# EAGLE design SCART_SWITCH-5CH (EAGLE 7.6.0)

## Sheet 1 of 2
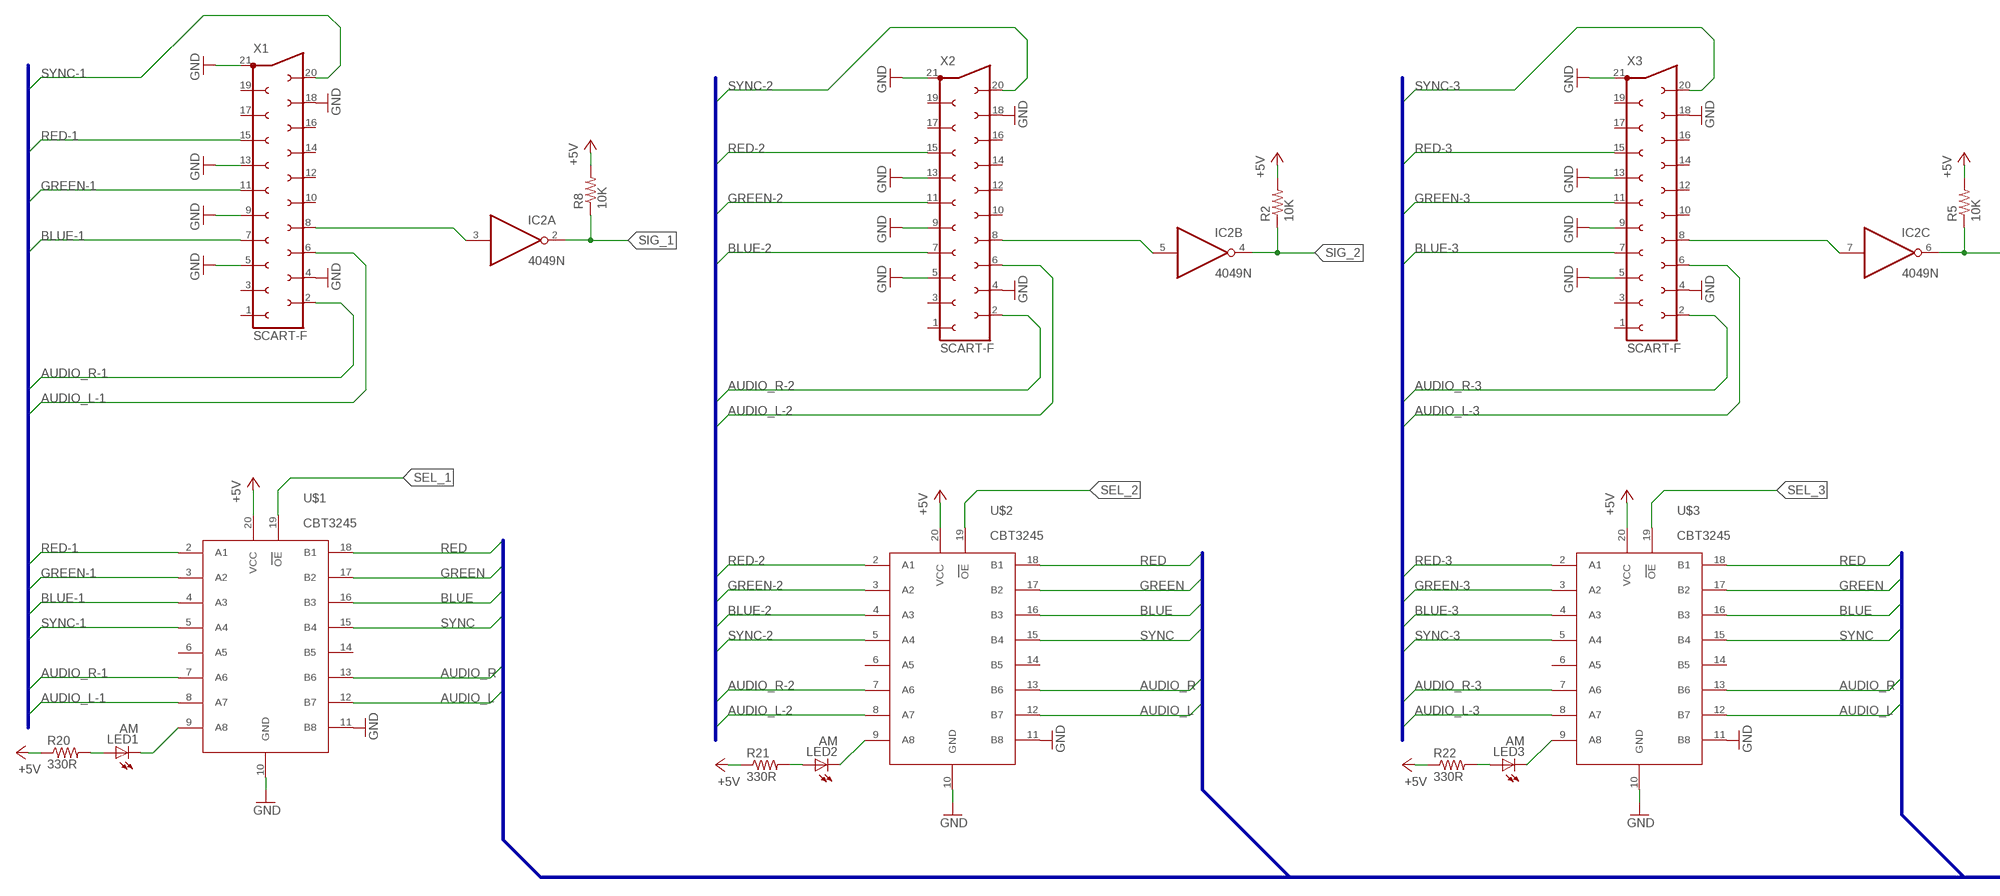
[diagram p0: schematic, sheet 1, part 1 of 2]
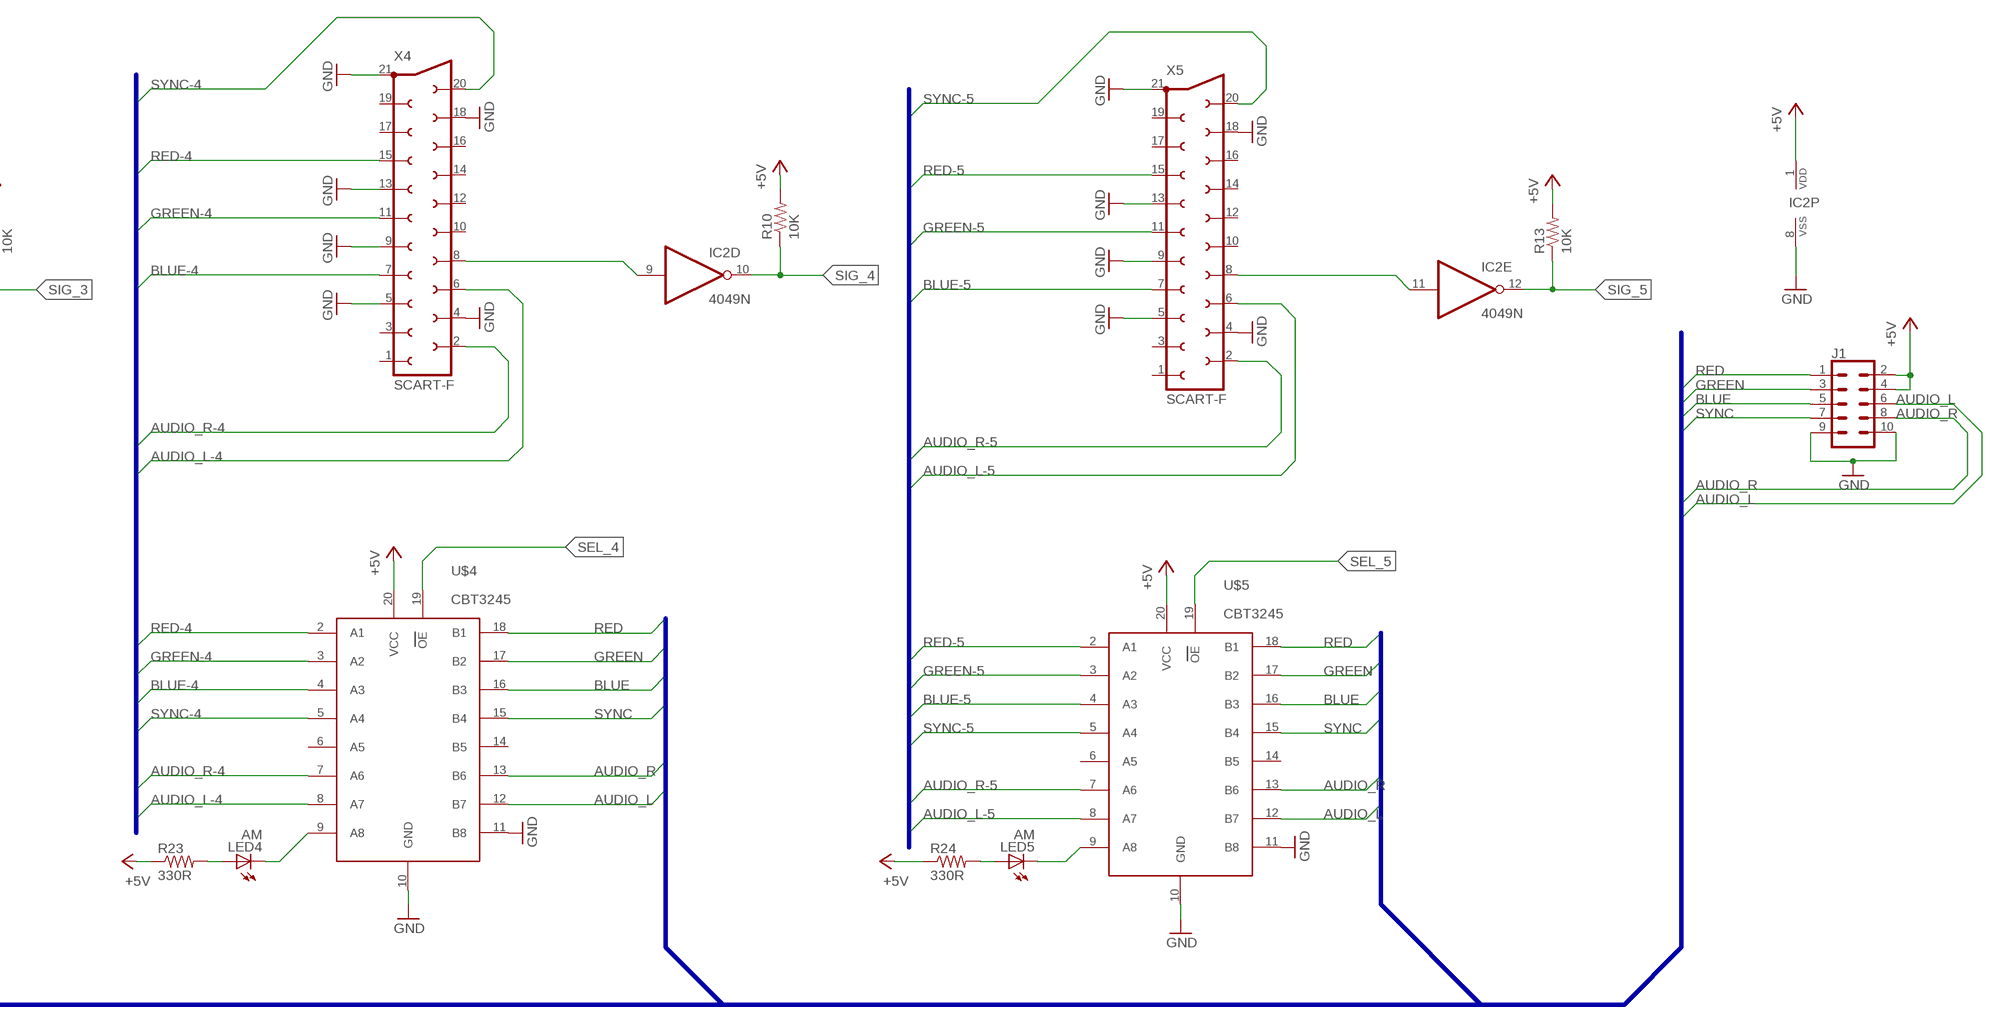
[diagram p1: schematic, sheet 1, part 2 of 2]

### Parts
IC2  4049N  [DIL16]
J1  CONN_05X2SHD  [2X5-SHROUDED]
LED1  AM  LED5MM  [LED5MM]
LED2  AM  LED5MM  [LED5MM]
LED3  AM  LED5MM  [LED5MM]
LED4  AM  LED5MM  [LED5MM]
LED5  AM  LED5MM  [LED5MM]
R2  10K  R-US_0204/7  [0204/7]
R5  10K  R-US_0204/7  [0204/7]
R8  10K  R-US_0204/7  [0204/7]
R10  10K  R-US_0204/7  [0204/7]
R13  10K  R-US_0204/7  [0204/7]
R20  330R  R-US_0207/2V  [0207/2V]
R21  330R  R-US_0207/2V  [0207/2V]
R22  330R  R-US_0207/2V  [0207/2V]
R23  330R  R-US_0207/2V  [0207/2V]
R24  330R  R-US_0207/2V  [0207/2V]
U$1  CBT3245  [SO20]
U$2  CBT3245  [SO20]
U$3  CBT3245  [SO20]
U$4  CBT3245  [SO20]
U$5  CBT3245  [SO20]
X1  SCART-F  [SCART-F]
X2  SCART-F  [SCART-F]
X3  SCART-F  [SCART-F]
X4  SCART-F  [SCART-F]
X5  SCART-F  [SCART-F]

### Nets
+5V: IC2.1(P:VDD) J1.2 J1.4 R2.2 R5.2 R8.2 R10.2 R13.2 R20.1 R21.1 R22.1 R23.1 R24.1 U$1.20(VCC) U$2.20(VCC) U$3.20(VCC) U$4.20(VCC) U$5.20(VCC) ; also sheet 2
AUDIO_L: J1.6 U$1.12(B7) U$2.12(B7) U$3.12(B7) U$4.12(B7) U$5.12(B7)
AUDIO_L-1: U$1.8(A7) X1.6
AUDIO_L-2: U$2.8(A7) X2.6
AUDIO_L-3: U$3.8(A7) X3.6
AUDIO_L-4: U$4.8(A7) X4.6
AUDIO_L-5: U$5.8(A7) X5.6
AUDIO_R: J1.8 U$1.13(B6) U$2.13(B6) U$3.13(B6) U$4.13(B6) U$5.13(B6)
AUDIO_R-1: U$1.7(A6) X1.2
AUDIO_R-2: U$2.7(A6) X2.2
AUDIO_R-3: U$3.7(A6) X3.2
AUDIO_R-4: U$4.7(A6) X4.2
AUDIO_R-5: U$5.7(A6) X5.2
BLUE: J1.5 U$1.16(B3) U$2.16(B3) U$3.16(B3) U$4.16(B3) U$5.16(B3)
BLUE-1: U$1.4(A3) X1.7
BLUE-2: U$2.4(A3) X2.7
BLUE-3: U$3.4(A3) X3.7
BLUE-4: U$4.4(A3) X4.7
BLUE-5: U$5.4(A3) X5.7
GND: IC2.8(P:VSS) J1.9 J1.10 U$1.10(GND) U$1.11(B8) U$2.10(GND) U$2.11(B8) U$3.10(GND) U$3.11(B8) U$4.10(GND) U$4.11(B8) U$5.10(GND) U$5.11(B8) X1.4 X1.5 X1.9 X1.13 X1.18 X1.21 X2.4 X2.5 X2.9 X2.13 X2.18 X2.21 X3.4 X3.5 X3.9 X3.13 X3.18 X3.21 X4.4 X4.5 X4.9 X4.13 X4.18 X4.21 X5.4 X5.5 X5.9 X5.13 X5.18 X5.21 ; also sheet 2
GREEN: J1.3 U$1.17(B2) U$2.17(B2) U$3.17(B2) U$4.17(B2) U$5.17(B2)
GREEN-1: U$1.3(A2) X1.11
GREEN-2: U$2.3(A2) X2.11
GREEN-3: U$3.3(A2) X3.11
GREEN-4: U$4.3(A2) X4.11
GREEN-5: U$5.3(A2) X5.11
N$1: IC2.3(A:I) X1.8
N$4: IC2.5(B:I) X2.8
N$7: IC2.7(C:I) X3.8
N$10: IC2.9(D:I) X4.8
N$14: IC2.11(E:I) X5.8
N$26: LED5.K(C) U$5.9(A8)
N$27: LED5.A R24.2
N$28: LED4.A R23.2
N$29: LED4.K(C) U$4.9(A8)
N$30: LED2.K(C) U$2.9(A8)
N$31: LED2.A R21.2
N$32: LED3.K(C) U$3.9(A8)
N$34: LED3.A R22.2
N$35: LED1.A R20.2
N$36: LED1.K(C) U$1.9(A8)
RED: J1.1 U$1.18(B1) U$2.18(B1) U$3.18(B1) U$4.18(B1) U$5.18(B1)
RED-1: U$1.2(A1) X1.15
RED-2: U$2.2(A1) X2.15
RED-3: U$3.2(A1) X3.15
RED-4: U$4.2(A1) X4.15
RED-5: U$5.2(A1) X5.15
SEL_1: U$1.19(OE) ; also sheet 2
SEL_2: U$2.19(OE) ; also sheet 2
SEL_3: U$3.19(OE) ; also sheet 2
SEL_4: U$4.19(OE) ; also sheet 2
SEL_5: U$5.19(OE) ; also sheet 2
SIG_1: IC2.2(A:O) R8.1 ; also sheet 2
SIG_2: IC2.4(B:O) R2.1 ; also sheet 2
SIG_3: IC2.6(C:O) R5.1 ; also sheet 2
SIG_4: IC2.10(D:O) R10.1 ; also sheet 2
SIG_5: IC2.12(E:O) R13.1 ; also sheet 2
SYNC: J1.7 U$1.15(B4) U$2.15(B4) U$3.15(B4) U$4.15(B4) U$5.15(B4)
SYNC-1: U$1.5(A4) X1.20
SYNC-2: U$2.5(A4) X2.20
SYNC-3: U$3.5(A4) X3.20
SYNC-4: U$4.5(A4) X4.20
SYNC-5: U$5.5(A4) X5.20
Unconnected: IC2.14(F:I) IC2.15(F:O) U$1.6(A5) U$1.14(B5) U$2.6(A5) U$2.14(B5) U$3.6(A5) U$3.14(B5) U$4.6(A5) U$4.14(B5) U$5.6(A5) U$5.14(B5) X1.1 X1.3 X1.10 X1.12 X1.14 X1.16 X1.17 X1.19 X2.1 X2.3 X2.10 X2.12 X2.14 X2.16 X2.17 X2.19 X3.1 X3.3 X3.10 X3.12 X3.14 X3.16 X3.17 X3.19 X4.1 X4.3 X4.10 X4.12 X4.14 X4.16 X4.17 X4.19 X5.1 X5.3 X5.10 X5.12 X5.14 X5.16 X5.17 X5.19

### Buses
B$1
B$2

## Sheet 2 of 2
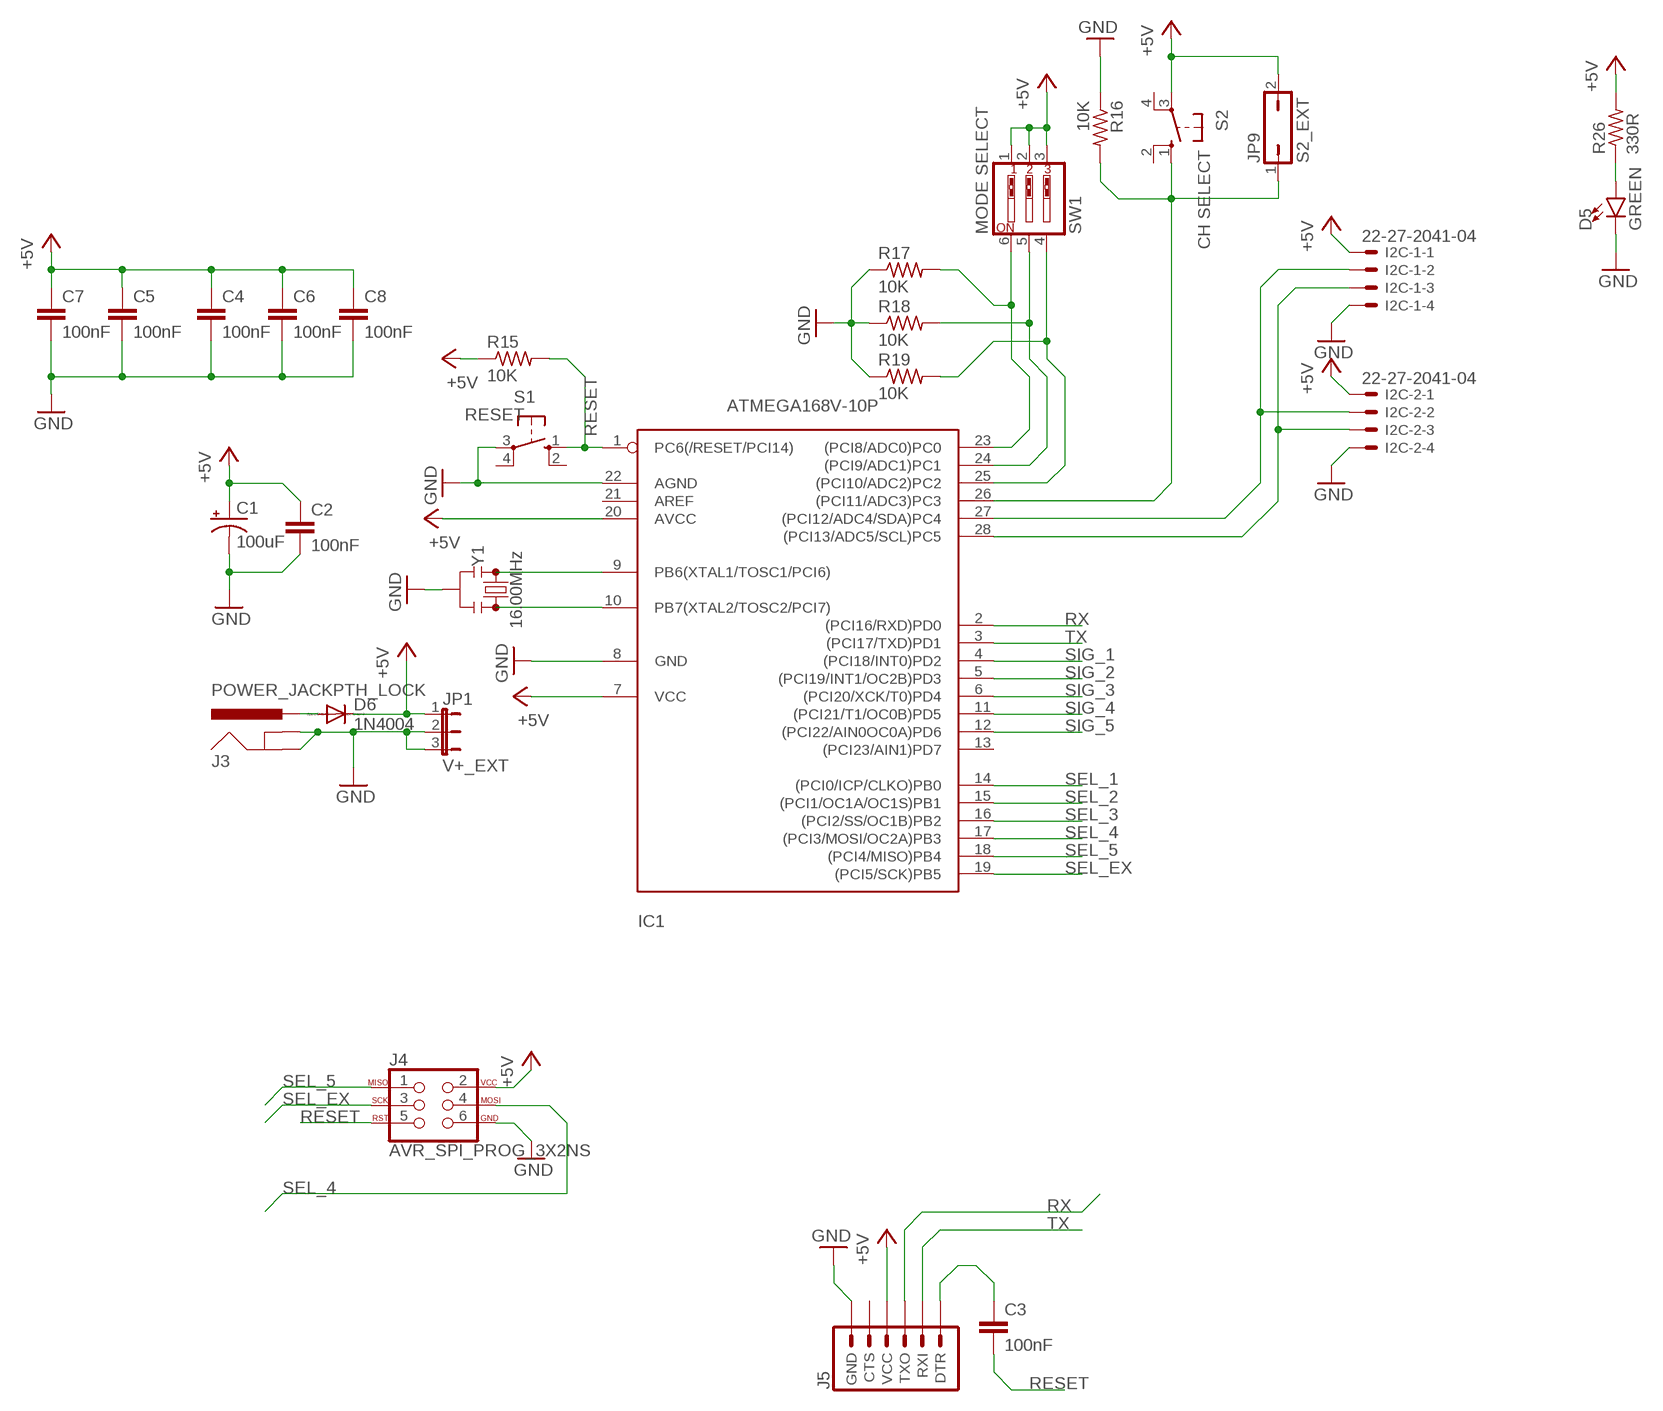
[diagram p2: schematic, sheet 2]

### Parts
C1  100uF  CPOL-USE2.5-7  [E2,5-7]
C2  100nF  C-EU075-032X103  [C075-032X103]
C3  100nF  C-EU075-032X103  [C075-032X103]
C4  100nF  C-EU075-032X103  [C075-032X103]
C5  100nF  C-EU075-032X103  [C075-032X103]
C6  100nF  C-EU075-032X103  [C075-032X103]
C7  100nF  C-EU075-032X103  [C075-032X103]
C8  100nF  C-EU075-032X103  [C075-032X103]
D5  GREEN  LED5MM  [LED_5MM]
D6  1N4004  [DO41-10]
I2C-1  22-27-2041-04  [6410-04]
I2C-2  22-27-2041-04  [6410-04]
IC1  ATMEGA168V-10P  [DIL28-3]
J3  POWER_JACKPTH_LOCK  [POWER_JACK_PTH_LOCK]
J4  AVR_SPI_PROG_3X2NS  [2X3-NS]
J5  6_PIN_SERIAL_TARGETSILK  [6_PIN_SERIAL_TARGET_SIDE_W_SILK]
JP1  V+_EXT  JP2E  [JP2]
JP9  S2_EXT  JP1Q  [JP1]
R15  10K  R-US_0204/7  [0204/7]
R16  10K  R-US_0204/7  [0204/7]
R17  10K  R-US_0204/7  [0204/7]
R18  10K  R-US_0204/7  [0204/7]
R19  10K  R-US_0204/7  [0204/7]
R26  330R  R-US_0204/7  [0204/7]
S1  RESET  10-XX  [B3F-10XX]
S2  CH SELECT  10-XX  [B3F-10XX]
SW1  MODE SELECT  SW_DIP-3  [EDG-03]
Y1  16.00MHz  RESONATORPTH-7.6X3.8  [RESONATOR-PTH-7.6X3.8]

### Nets
+5V: C1.+ C2.1 C4.1 C5.1 C6.1 C7.1 C8.1 D6.C I2C-1.1 I2C-2.1 IC1.7(VCC) IC1.20(AVCC) J4.2 J5.P$4(VCC) JP1.1 JP9.2 R15.1 R26.2 S2.3(P) SW1.1 SW1.2 SW1.3 ; also sheet 1
GND: C1.- C2.2 C4.2 C5.2 C6.2 C7.2 C8.2 D5.K(C) I2C-1.4 I2C-2.4 IC1.8(GND) IC1.22(AGND) J3.GND J3.GNDBREAK J4.6 J5.P$6(GND) JP1.2 JP1.3 R16.1 R17.1 R18.1 R19.1 S1.3(P) Y1.2 ; also sheet 1
N$15: IC1.9(PB6(XTAL1/TOSC1/PCI6)) Y1.1
N$16: IC1.10(PB7(XTAL2/TOSC2/PCI7)) Y1.3
N$17: I2C-1.2 I2C-2.2 IC1.27((PCI12/ADC4/SDA)PC4)
N$18: I2C-1.3 I2C-2.3 IC1.28((PCI13/ADC5/SCL)PC5)
N$19: IC1.26((PCI11/ADC3)PC3) JP9.1 R16.2 S2.1(S)
N$20: IC1.23((PCI8/ADC0)PC0) R17.2 SW1.6
N$21: IC1.24((PCI9/ADC1)PC1) R18.2 SW1.5
N$22: IC1.25((PCI10/ADC2)PC2) R19.2 SW1.4
N$23: C3.1 J5.P$1(DTR)
N$24: D5.A R26.1
N$25: D6.A J3.PWR
RESET: C3.2 IC1.1(PC6(/RESET/PCI14)) J4.5 R15.2 S1.1(S)
RX: IC1.2((PCI16/RXD)PD0) J5.P$2(TXO)
SEL_1: IC1.14((PCI0/ICP/CLKO)PB0) ; also sheet 1
SEL_2: IC1.15((PCI1/OC1A/OC1S)PB1) ; also sheet 1
SEL_3: IC1.16((PCI2/SS/OC1B)PB2) ; also sheet 1
SEL_4: IC1.17((PCI3/MOSI/OC2A)PB3) J4.4 ; also sheet 1
SEL_5: IC1.18((PCI4/MISO)PB4) J4.1 ; also sheet 1
SEL_EX: IC1.19((PCI5/SCK)PB5) J4.3
SIG_1: IC1.4((PCI18/INT0)PD2) ; also sheet 1
SIG_2: IC1.5((PCI19/INT1/OC2B)PD3) ; also sheet 1
SIG_3: IC1.6((PCI20/XCK/T0)PD4) ; also sheet 1
SIG_4: IC1.11((PCI21/T1/OC0B)PD5) ; also sheet 1
SIG_5: IC1.12((PCI22/AIN0OC0A)PD6) ; also sheet 1
TX: IC1.3((PCI17/TXD)PD1) J5.P$3(RXI)
Unconnected: IC1.13((PCI23/AIN1)PD7) IC1.21(AREF) J5.P$5(CTS) S1.2(S1) S1.4(P1) S2.2(S1) S2.4(P1)

## Library data of the parts
C1 = rcl:CPOL-US: POLARIZED CAPACITOR, American symbol
C2-C8 = rcl:C-EU: CAPACITOR, European symbol
D5 = SparkFun-LED:LED: LED (Generic) Standard schematic elements and footprints for 5mm, 3mm, 1206, and 0603 sized LEDs. Generic LEDs with no color specified.
D6 = diode:1N4004: DIODE general purpose rectifier, 1 A
I2C-1 I2C-2 = con-molex:22-?-04: CONNECTOR wire to board 2.54 mm (.1 inch) pitch header; OC_FARNELL: unknown; OC_NEWARK: unknown
IC1 = adafruit:ATMEGA168*P: MICROCONTROLLER 16 kBytes FLASH 1 kBytes SRAM 512 Bytes EEPROM USART 8-channel 10 bit ADC
IC2 = 40xx:4049: Hex inverting BUFFER
J1 = SparkFun-Connectors:CONN_05X2: Multi connection point. Often used as Generic Header-pin footprint for 0.1 inch spaced/style header connections For AVR SPI programming port, see special device with nice symbol: "AVR_SPI_PROG_5x2.dev" You can populate with any combo of single row headers, but if you'd like an exact match, check these: 2x5 AVR ICSP Male Header <https://www.sparkfun.com/products/778> (PRT-00778) 2x5 Pin Shrouded Header <https://www.sparkfun.com/products/8506> (PRT-08506) On any of the 0.1 inch spaced packages, you can populate with these: Break Away Headers - Straight <https://www.sparkfun.com/products/116> (PRT-00116) Break Away Male Headers - Right Angle <https://www.sparkfun.com/products/553> (PRT-00553) Female Headers <https://www.sparkfun.com/products/115> (PRT-00115) Break Away Headers - Machine Pin <https://www.sparkfun.com/products/117> (PRT-00117) Break Away Female Headers - Swiss Machine Pin <https://www.sparkfun.com/products/743> (PRT-00743) Special note: the shrouded connector mates well with our 5x2 ribbon cables: 2x5 Pin IDC Ribbon Cable <https://www.sparkfun.com/products/8535> (PRT-08535); PROD_ID: CONN-08671; SF_ID: PRT-08506
J3 = SparkFun-Connectors:POWER_JACK: Power Jack Connector This is the standard 5.5mm barrel jack for power. The PTH is the most common, proven, reliable, footprint. The Slot footprint only works if the mill layer is transmitted to the PCB fab house so be warned. Here are the connectors we sell at SparkFun: DC Barrel Power Jack/Connector <https://www.sparkfun.com/products/119> (PRT-00119) DC Barrel Power Jack/Connector (SMD) <https://www.sparkfun.com/products/12748> (PRT-12748) DC Barrel Jack Adapter - Breadboard Compatible <https://www.sparkfun.com/products/10811> (PRT-10811) It is used on this SparkFun product (and many, many others): SparkFun RedBoard - Programmed with Arduino <https://www.sparkfun.com/products/12757> (DEV-12757) Also, if you need a mating power supply or connector, please check these out: Wall Adapter Power Supply - 9VDC 650mA <https://www.sparkfun.com/products/298> (TOL-00298) DC Barrel Jack Adapter - Male <https://www.sparkfun.com/products/10287> (PRT-10287); PROD_ID: CONN-08197; SF_ID: PRT-00119
J4 = SparkFun-Connectors:AVR_SPI_PROG_3X2: AVR ISP 6 Pin This is the reduced ISP connector for AVR programming. Common on Arduino. This footprint will take up less PCB space and can be used with a 10-pin to 6-pin adapter such as SKU: BOB-08508 **Special note about "TEST_POINT" package. The stop mask is on the top side, so if you want your programming test points to be on the bottom of your board, make sure to place this package on the bottom side of the board. This also ensure that the orientation to program from the bottom side will be correct. SparkFun Products: SparkFun ISP Pogo Adapter <https://www.sparkfun.com/products/11591> - NS Tiny AVR Programmer <https://www.sparkfun.com/products/11801> -PTH
J5 = SparkFun-Connectors:6_PIN_SERIAL_TARGET: 6-pin header connection for use with the "FTDI BASIC" pinout - TARGET SIDE. Also known as "Arduino Serial Program Header". It is used to mate with our FTDI Basic serial programmers using the Arduino IDE. Note, this device has "TARGET" in the name. It is intended to be used on a design that contains a target micro-controller that you wish to program. The "sister" device, named "CABLE" is inteneded to be used on a design that usually lives on the end of your USB cable and prvides the converter chip (FTDI232 or FTDI231x) to commnicate serial RX/TX. You can populate with some of these: Break Away Headers - Straight <https://www.sparkfun.com/products/116> (PRT-00116) For reference (or to suit your programming needs) check out these designs: SparkFun FTDI Basic Breakout - 5V <https://www.sparkfun.com/products/9716> (DEV-09716) SparkFun FTDI Basic Breakout - 3.3V <https://www.sparkfun.com/products/9873> (DEV-09873) SparkFun FTDI SmartBasic <https://www.sparkfun.com/products/12935> (DEV-12935) SparkFun Beefy 3 - FTDI Basic Breakout <https://www.sparkfun.com/products/13746> (DEV-13746)
JP1 = jumper:JP2E: JUMPER
JP9 = jumper:JP1Q: JUMPER
LED1-LED5 = led:LED: LED OSRAM: - CHIPLED LG R971, LG N971, LY N971, LG Q971, LY Q971, LO R971, LY R971 LH N974, LH R974 LS Q976, LO Q976, LY Q976 LO Q996 - Hyper CHIPLED LW Q18S LB Q993, LB Q99A, LB R99A - SideLED LS A670, LO A670, LY A670, LG A670, LP A670 LB A673, LV A673, LT A673, LW A673 LH A674 LY A675 LS A676, LA A676, LO A676, LY A676, LW A676 LS A679, LY A679, LG A679 - Hyper Micro SIDELED® LS Y876, LA Y876, LO Y876, LY Y876 LT Y87S - SmartLED LW L88C, LW L88S LB L89C, LB L89S, LG L890 LS L89K, LO L89K, LY L89K LS L896, LA L896, LO L896, LY L896 - TOPLED LS T670, LO T670, LY T670, LG T670, LP T670 LSG T670, LSP T670, LSY T670, LOP T670, LYG T670 LG T671, LOG T671, LSG T671 LB T673, LV T673, LT T673, LW T673 LH T674 LS T676, LA T676, LO T676, LY T676, LB T676, LH T676, LSB T676, LW T676 LB T67C, LV T67C, LT T67C, LS T67K, LO T67K, LY T67K, LW E67C LS E67B, LA E67B, LO E67B, LY E67B, LB E67C, LV E67C, LT E67C LW T67C LS T679, LY T679, LG T679 LS T770, LO T770, LY T770, LG T770, LP T770 LB T773, LV T773, LT T773, LW T773 LH T774 LS E675, LA E675, LY E675, LS T675 LS T776, LA T776, LO T776, LY T776, LB T776 LHGB T686 LT T68C, LB T68C - Hyper Mini TOPLED® LB M676 - Mini TOPLED Santana® LG M470 LS M47K, LO M47K, LY M47K Source: http://www.osram.convergy.de LUXEON: - LUMILED® LXK2-PW12-R00, LXK2-PW12-S00, LXK2-PW14-U00, LXK2-PW14-V00 LXK2-PM12-R00, LXK2-PM12-S00, LXK2-PM14-U00 LXK2-PE12-Q00, LXK2-PE12-R00, LXK2-PE12-S00, LXK2-PE14-T00, LXK2-PE14-U00 LXK2-PB12-K00, LXK2-PB12-L00, LXK2-PB12-M00, LXK2-PB14-N00, LXK2-PB14-P00, LXK2-PB14-Q00 LXK2-PR12-L00, LXK2-PR12-M00, LXK2-PR14-Q00, LXK2-PR14-R00 LXK2-PD12-Q00, LXK2-PD12-R00, LXK2-PD12-S00 LXK2-PH12-R00, LXK2-PH12-S00 LXK2-PL12-P00, LXK2-PL12-Q00, LXK2-PL12-R00 Source: www.luxeon.com KINGBRIGHT: KA-3528ASYC Source: www.kingbright.com
R2 R5 R8 R10 R13 R26 = resistor:R-US_: RESISTOR, American symbol
R15-R24 = rcl:R-US_: RESISTOR, American symbol
S1 S2 = switch-omron:10-XX: OMRON SWITCH; MPN: B3F-1000; OC_FARNELL: 176432; OC_NEWARK: 36M3542
SW1 = special:SW_DIP-3: DIP SWITCH
U$1-U$5 = CBT3245:CBT3245
X1-X5 = con-hirschmann:SCART-F: TV SCART CONNECTOR; OC_FARNELL: unknown; OC_NEWARK: unknown
Y1 = SparkFun-Clocks:RESONATOR: Resonators (Generic) Ceramic resonators are clock-generating components, often used to control timing in microcontrollers. They usually have 3 pins: two pins for oscillation, and one pin for ground. Compared to crystals, resonators have worse tolerance, but are usually much cheaper. Plus, they have built-in load capacitors! These devices are used on boards like the Arduino Pro 8MHz <https://www.sparkfun.com/products/11114> and Arduino Pro 16MHz <https://www.sparkfun.com/products/11113>.

## Net classes
0 default: width 0.5 mm
1 power: width 0.65 mm

## Board
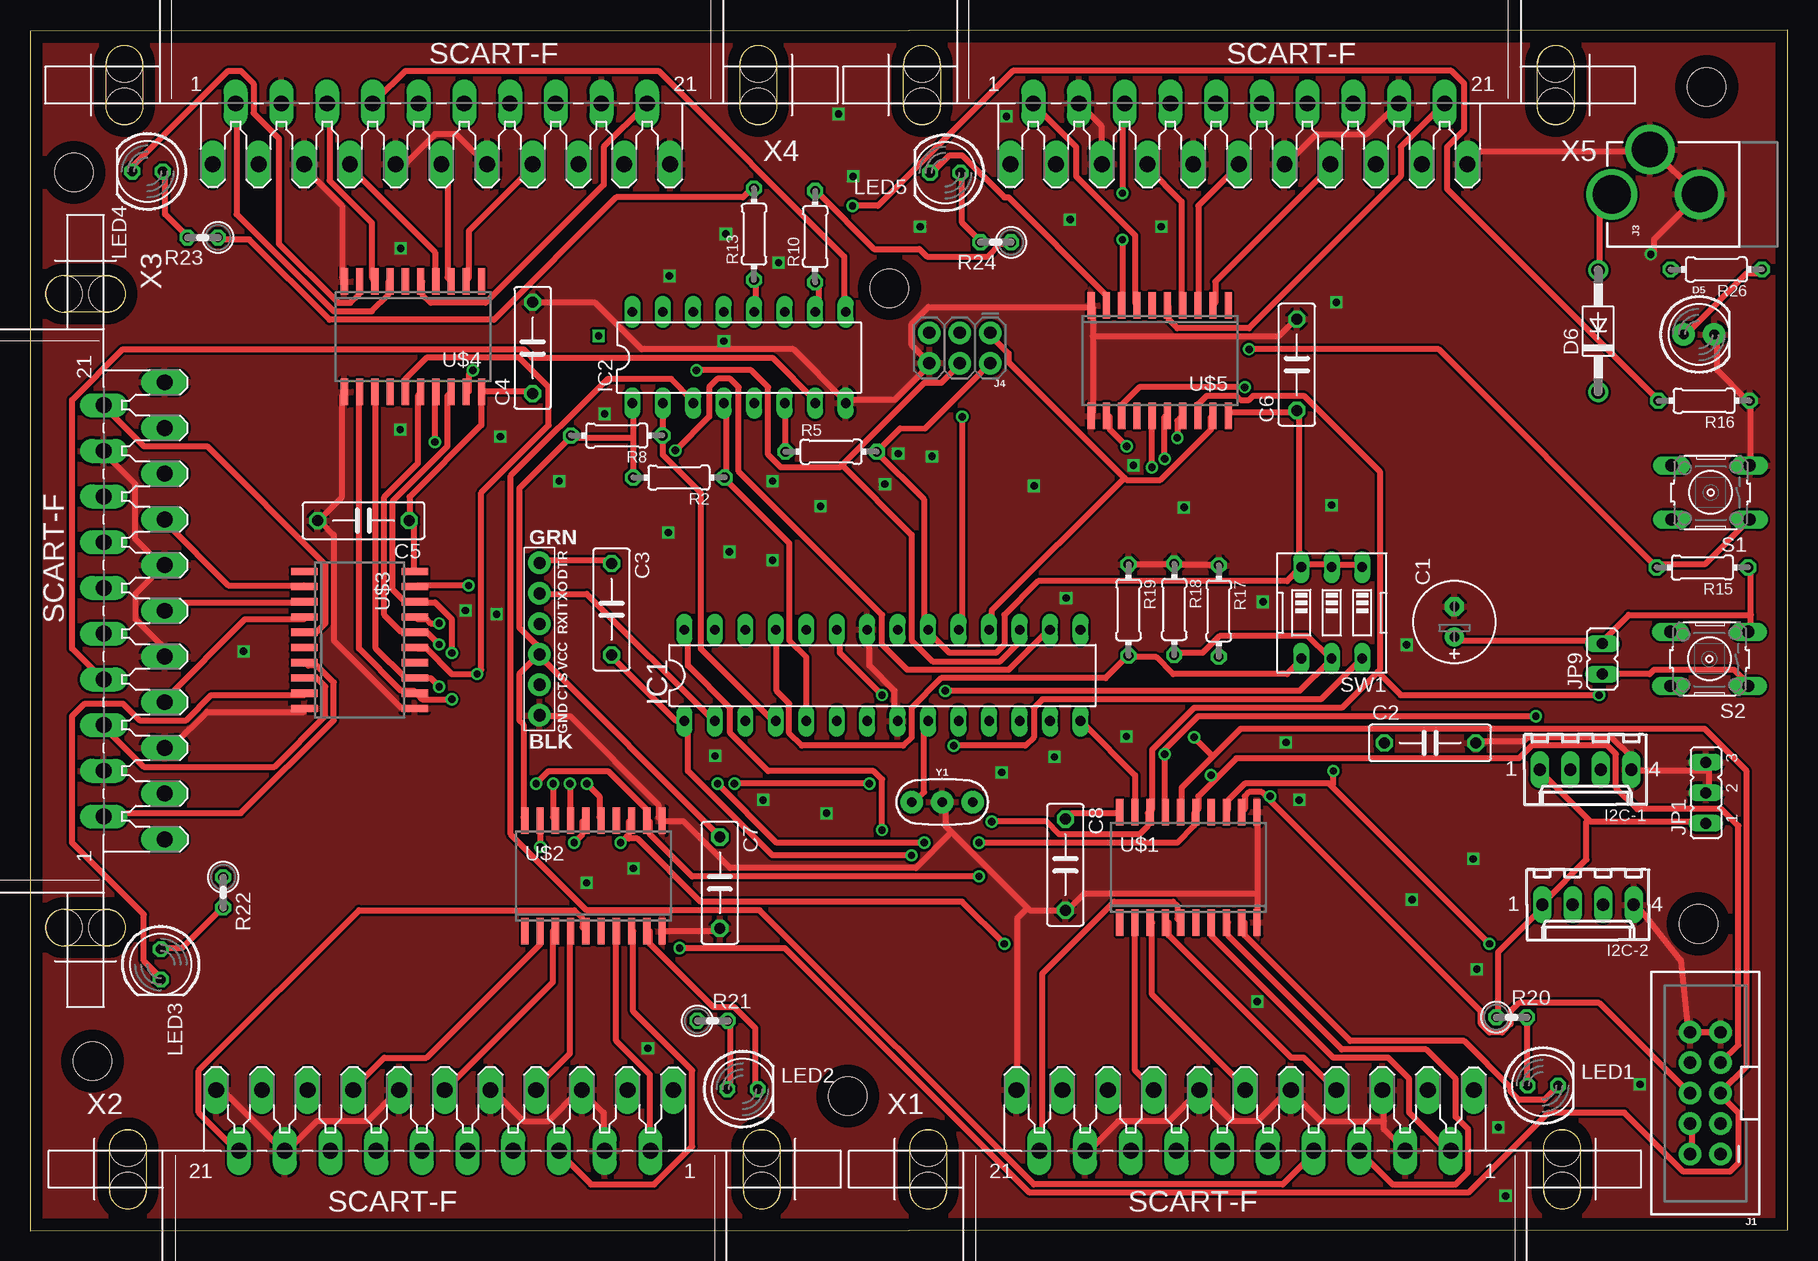
[diagram p3: board, top side]
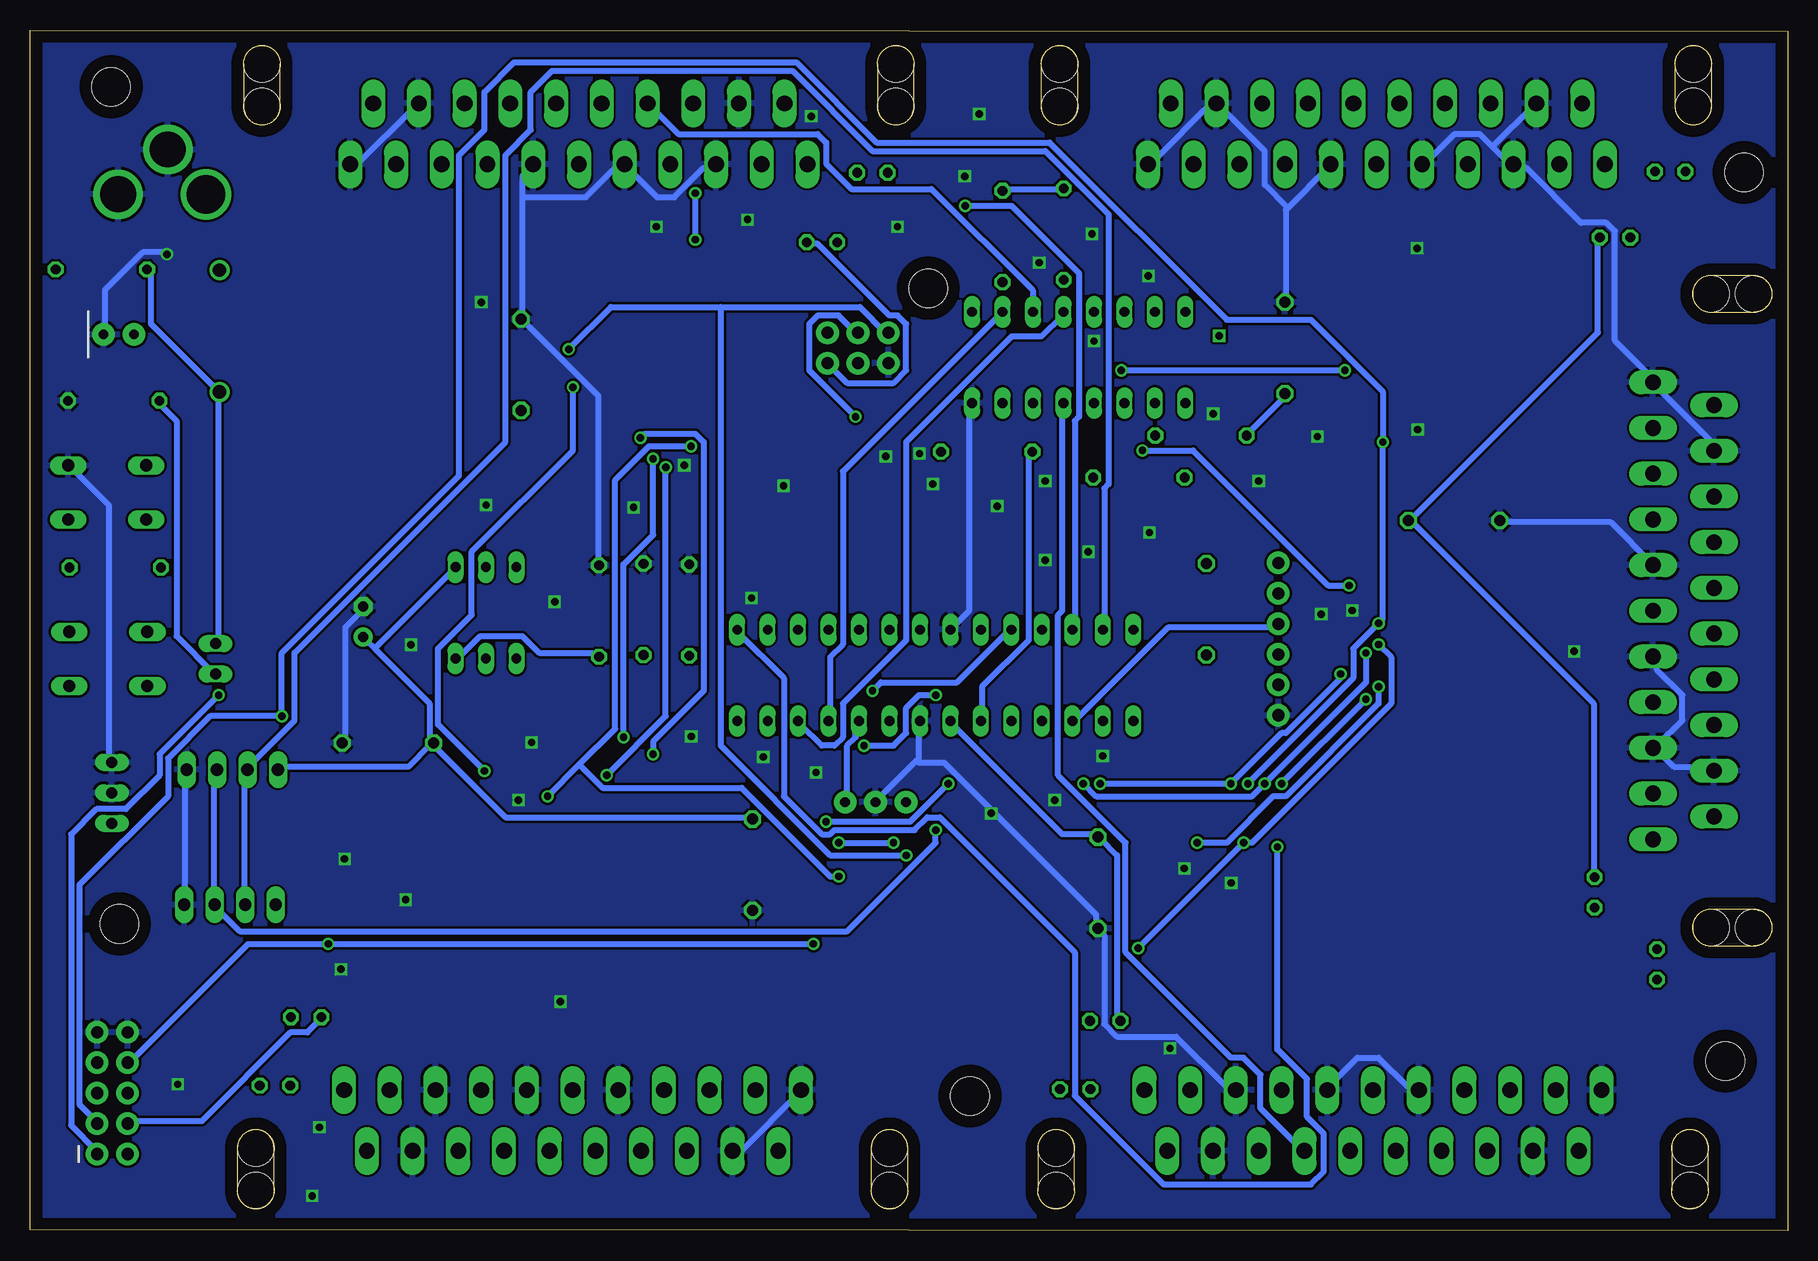
[diagram p4: board, bottom side, seen from below]

Size 146.52 x 100.1 mm. Coordinates in mm from the lower left corner, seen from the top.
Outline: 0,0 146.52,0.1 146.52,100.1 0,100 0,0
Copper layers (1*16): Top 0.035mm / dielectric 1.5mm / Bottom 0.035mm
Design rules "default": minimum track width 10mil, minimum drill 24mil, track to track 8mil, track to pad 8mil, pad to pad 8mil, via to via 8mil, smd to smd 8mil, copper to edge 40mil, drill to drill 8mil, minimum pad ring 10mil, minimum via ring 8mil, stop-mask expansion 4mil, vias tented up to drill 0mil, thermal gap 10mil
Holes 3.2 mm at 5.21,14.14 3.65,88.23 139.76,95.36 139.07,25.58 68.17,11.23 71.64,78.57

### Footprints (pad centres in the part's own frame; a part is rotated, then mirrored left to right if it is on the bottom)
E2,5-7 = drill 0.813 pad 1.6: + -1.27,0 | drill 0.813 pad 1.6 octagon: - 1.27,0
C075-032X103 = drill 0.914 octagon: 1 -3.81,0; 2 3.81,0
LED_5MM = drill 0.813 pad 1.88: A -1.27,0; K 1.27,0
DO41-10 = drill 1.118: A 5.08,0; C -5.08,0
6410-04 = drill 1.016 long: 1 3.81,0; 2 1.27,0; 3 -1.27,0; 4 -3.81,0
DIL28-3 = drill 0.813 long: 1 -16.51,-3.81; 2 -13.97,-3.81; 3 -11.43,-3.81; 4 -8.89,-3.81; 5 -6.35,-3.81; 6 -3.81,-3.81; 7 -1.27,-3.81; 8 1.27,-3.81; 9 3.81,-3.81; 10 6.35,-3.81; 11 8.89,-3.81; 12 11.43,-3.81; 13 13.97,-3.81; 14 16.51,-3.81; 15 16.51,3.81; 16 13.97,3.81; 17 11.43,3.81; 18 8.89,3.81; 19 6.35,3.81; 20 3.81,3.81; 21 1.27,3.81; 22 -1.27,3.81; 23 -3.81,3.81; 24 -6.35,3.81; 25 -8.89,3.81; 26 -11.43,3.81; 27 -13.97,3.81; 28 -16.51,3.81
DIL16 = drill 0.813 long: 1 -8.89,-3.81; 2 -6.35,-3.81; 3 -3.81,-3.81; 4 -1.27,-3.81; 5 1.27,-3.81; 6 3.81,-3.81; 7 6.35,-3.81; 8 8.89,-3.81; 9 8.89,3.81; 10 6.35,3.81; 11 3.81,3.81; 12 1.27,3.81; 13 -1.27,3.81; 14 -3.81,3.81; 15 -6.35,3.81; 16 -8.89,3.81
2X5-SHROUDED = drill 1.016 pad 1.88: 1 -1.27,5.08; 2 1.27,5.08; 3 -1.27,2.54; 4 1.27,2.54; 5 -1.27,0; 6 1.27,0; 7 -1.27,-2.54; 8 1.27,-2.54; 9 -1.27,-5.08; 10 1.27,-5.08
POWER_JACK_PTH_LOCK = drill 2.997 pad 4.115: GND 0.025,6.557; GNDBREAK 3.762,10.7 | drill 3.2 pad 4.115: PWR 0,13.878
2X3-NS = drill 1.016 pad 1.88: 1 -2.54,-1.27; 2 -2.54,1.27; 3 0,-1.27; 4 0,1.27; 5 2.54,-1.27; 6 2.54,1.27
6_PIN_SERIAL_TARGET_SIDE_W_SILK = drill 1.016 pad 1.88: P$1 -6.35,0; P$2 -3.81,0; P$3 -1.27,0; P$4 1.27,0; P$5 3.81,0; P$6 6.35,0
JP2 = drill 0.914 long: 1 -2.54,0; 2 0,0; 3 2.54,0
JP1 = drill 0.914 long: 1 0,-1.27; 2 0,1.27
LED5MM = drill 0.813 octagon: A -1.27,0; K 1.27,0
0204/7 = drill 0.813 octagon: 1 -3.81,0; 2 3.81,0
0207/2V = drill 0.813 octagon: 1 -1.27,0; 2 1.27,0
B3F-10XX = drill 1.016 long: 1 -3.251,2.261; 2 3.251,2.261; 3 -3.251,-2.261; 4 3.251,-2.261
EDG-03 = drill 0.813 long: 1 -2.54,-3.81; 2 0,-3.81; 3 2.54,-3.81; 4 2.54,3.81; 5 0,3.81; 6 -2.54,3.81
SO20 = smd 0.6 x 2.2: 1 -5.715,-4.6; 2 -4.445,-4.6; 3 -3.175,-4.6; 4 -1.905,-4.6; 5 -0.635,-4.6; 6 0.635,-4.6; 7 1.905,-4.6; 8 3.175,-4.6; 9 4.445,-4.6; 10 5.715,-4.6; 11 5.715,4.6; 12 4.445,4.6; 13 3.175,4.6; 14 1.905,4.6; 15 0.635,4.6; 16 -0.635,4.6; 17 -1.905,4.6; 18 -3.175,4.6; 19 -4.445,4.6; 20 -5.715,4.6
SCART-F = drill 1.321 long: 1 19.05,5.08; 2 17.145,0; 3 15.24,5.08; 4 13.335,0; 5 11.43,5.08; 6 9.525,0; 7 7.62,5.08; 8 5.715,0; 9 3.81,5.08; 10 1.905,0; 11 0,5.08; 12 -1.905,0; 13 -3.81,5.08; 14 -5.715,0; 15 -7.62,5.08; 16 -9.525,0; 17 -11.43,5.08; 18 -13.335,0; 19 -15.24,5.08; 20 -17.145,0; 21 -19.05,5.08 | hole 3.023: 26.416,0.254; 26.416,-3.302; -26.416,0.254; -26.416,-3.302
RESONATOR-PTH-7.6X3.8 = drill 0.8 pad 1.88: 1 -2.54,0; 2 0,0; 3 2.54,0

### Placement (x,y rotation side)
C1  118.74,50.76 90 top
C2  116.7,40.67 0 top
C3  48.47,51.8 270 top
C4  41.9,73.6 90 top
C5  27.8,59.2 180 top
C6  105.6,72.2 90 top
C7  57.5,29 270 top
C8  86.3,30.5 270 top
D5  139.12,74.72 0 top
D6  130.72,75 90 top
I2C-1  129.66,38.44 180 top
I2C-2  129.86,27.18 180 top
IC1  71.06,46.3 0 top
IC2  59.1,72.8 0 top
J1  139.65,11.47 180 top
J3  145.73,86.38 90 top
J4  77.5,73.59 180 top
J5  42.47,49.32 270 top
JP1  139.69,36.51 90 top
JP9  131.06,47.68 0 top
LED1  126.1,12.1 0 top
LED2  59.4,11.8 0 top
LED3  10.9,22.2 270 top
LED4  9.8,88.3 180 top
LED5  76.3,88.2 180 top
R2  54.09,62.79 180 top
R5  66.78,64.94 0 top
R8  48.91,66.29 180 top
R10  65.45,82.88 90 top
R13  60.35,83.08 90 top
R15  139.41,55.29 180 top
R16  139.54,69.19 180 top
R17  99.09,51.66 270 top
R18  95.38,51.8 270 top
R19  91.57,51.74 270 top
R20  123.5,17.8 0 top
R21  56.9,17.5 0 top
R22  16.1,28.2 270 top
R23  14.4,82.8 180 top
R24  80.5,82.4 180 top
R26  140.57,80.14 180 top
S1  140.09,61.54 180 top
S2  139.99,47.67 180 top
SW1  108.51,51.51 180 top
U$1  96.55,30.3 0 top
U$2  46.97,29.57 0 top
U$3  27.47,49.25 270 top
U$4  31.92,74.53 180 top
U$5  94.17,72.53 180 top
X1  101.29,6.65 0 top
X2  34.57,6.65 0 top
X3  6.15,51.68 270 top
X4  34.29,93.98 180 top
X5  100.77,93.98 180 top
Y1  76.04,35.74 0 top

### Tracks (layer width: path | path; a pad name or v marks a point on that pad's centre or on a via)
+5V
  Top 0.5: U$3.20 32,55.2 32,58.72 31.64,59.07 C5.1 31.64,59.42 31.64,61.18 37.62,67.16 37.62,69.62 U$4.20 37.62,69.97 41.84,69.97 C4.1 | U$2.20 41.14,34.46 41.14,42.19 40.79,42.54 40.79,46.41 42.19,47.82 J5.P$4 | 50.28,66.1 50.28,68.91 IC2.1 | 50.28,66.1 50.28,62.94 R2.2 | 50.28,66.1 45.36,66.1 R8.2 45.01,66.1 40.79,61.88 40.79,50.28 42.19,48.87 42.19,48.17 J5.P$4 | C7.1 57.31,33.05 42.54,47.82 J5.P$4 | R24.1 81.57,82.27 80.87,82.27 79.81,81.22 74.77,81.22 74.14,81.85 70.35,81.85 65.75,86.49 R10.2 | 70.57,64.92 70.67,64.69 R5.2 | 70.57,64.92 74.52,60.98 74.54,50.28 IC1.20 74.89,49.93 76.65,48.17 80.52,48.17 81.22,48.87 81.22,51.33 84.03,54.15 104.78,54.15 105.83,55.2 SW1.3 | 70.57,64.92 72.55,66.89 74.62,66.89 79.81,72.08 J4.2 | 129.92,34.28 125.87,38.32 I2C-1.1 | 129.92,34.28 130.09,34.1 139.59,34.1 JP1.1 | J1.2 138.53,6.68 138.53,8.79 J1.4 | R20.1 122.36,17.93 122.36,23.21 126.22,27.07 I2C-2.1 126.22,27.43 129.74,30.94 129.74,34.1 129.92,34.28 | 143.45,51.33 143.45,50.28 S2.3 | 143.45,51.33 143.45,55.2 R15.1 | U$5.20 99.85,68.21 105.48,68.21 C6.1 105.83,68.21 105.83,55.55 SW1.3 | SW1.3 106.18,55.55 108.29,55.55 SW1.2 108.64,55.55 110.75,55.55 SW1.1 | U$1.20 90.71,34.81 86.84,34.81 86.49,34.46 C8.1 | C1.+ 118.84,49.22 130.79,49.22 JP9.2 131.15,49.22 133.26,51.33 143.45,51.33 | R23.1 15.82,82.63 18.28,82.63 24.96,75.95 38.68,75.95 48.87,86.14 59.42,86.14 60.12,86.84 R13.2
  Bottom 0.5: R22.1 16.17,29.53 16.17,43.95 31.29,59.07 C5.1 31.29,59.42 15.82,74.89 15.82,82.63 R23.1 | R21.1 55.9,17.58 55.9,31.29 57.31,32.7 C7.1 57.66,33.05 60.48,33.05 69.62,42.19 IC1.7 | R8.2 45.01,66.45 41.84,69.62 C4.1 | R13.2 60.48,86.84 65.4,86.84 R10.2 | R24.1 81.57,82.27 80.87,82.27 74.89,76.3 74.19,76.3 73.48,75.59 73.48,71.73 74.54,70.67 78.41,70.67 79.81,72.08 J4.2 | J1.4 138.18,9.14 132.2,9.14 124.82,16.52 123.41,16.52 122.36,17.58 R20.1 | R26.2 136.42,79.81 136.42,75.59 130.79,69.97 D6.C 130.79,69.62 130.79,49.22 JP9.2 | 117.79,48.52 118.49,49.22 C1.+ | 117.79,48.52 113.22,43.95 113.22,40.79 C2.1 | C8.1 86.49,34.46 106.89,34.46 112.86,40.43 C2.1 | 117.79,48.52 111.11,55.2 SW1.1 | I2C-1.1 125.52,38.68 114.97,38.68 113.22,40.43 C2.1
AUDIO_L  (via drill 0.61)
  Top 0.5: v42.19,37.27 43.25,38.32 48.17,38.32 51.33,35.16 51.33,34.46 U$2.12 51.69,34.1 51.69,33.05 55.2,29.53 v79.11,29.53 | v35.16,44.3 32.7,44.3 32.35,44.65 U$3.12 32,45.01 30.94,45.01 27.43,48.52 27.43,69.62 U$4.12 | 103.19,36.04 120.95,18.28 120.95,17.23 121.65,16.52 122.71,16.52 123.41,17.23 123.41,18.28 124.11,18.99 130.79,18.99 138.18,11.6 J1.6 | 103.19,36.04 102.67,36.57 101.61,36.57 101.26,36.22 101.26,35.16 U$1.12 | v91.42,65.4 90.01,66.8 90.01,67.86 U$5.12 | v103.37,36.22 103.19,36.04
  Bottom 0.5: v35.16,44.3 v42.19,37.27 | v91.42,65.4 94.93,65.4 97.75,62.59 97.75,41.84 100.73,38.85 | v103.37,36.22 100.73,38.85 | v79.11,29.53 79.81,29.53 87.2,36.92 98.8,36.92 100.73,38.85
AUDIO_L-1
  Top 0.5: U$1.8 99.85,25.67 99.85,24.61 109.35,15.12 116.38,15.12 118.84,12.66 118.84,9.49 119.9,8.44 119.9,4.92 118.84,3.87 113.57,3.87 111.11,6.33 X1.6
AUDIO_L-2
  Top 0.5: U$2.8 50.28,24.96 50.28,18.28 55.2,13.36 55.2,7.03 52.04,3.87 46.76,3.87 44.3,6.33 X2.6
AUDIO_L-3
  Top 0.5: U$3.8 23.21,46.06 23.91,46.06 24.61,45.36 24.61,42.9 20.39,38.68 9.49,38.68 6.33,41.84 X3.6
AUDIO_L-4
  Top 0.5: U$4.8 28.48,79.46 28.48,84.03 24.96,87.55 24.96,93.88 X4.6
AUDIO_L-5  (via drill 0.61)
  Top 0.5: v91.06,82.63 91.06,77.35 U$5.8 | v91.06,86.49 91.06,93.88 X5.6
  Bottom 0.5: v91.06,86.49 v91.06,82.63
AUDIO_R  (via drill 0.61)
  Top 0.5: v49.22,32.35 49.75,32.88 | 49.75,32.88 49.93,33.05 49.93,34.1 U$2.13 | v34.1,45.36 33.4,46.06 32.35,46.06 U$3.13 32,46.06 31.29,46.06 28.83,48.52 28.83,69.62 U$4.13 | v121.65,23.91 108.47,37.09 | 108.47,37.09 108.29,37.27 101.26,37.27 99.85,35.86 99.85,35.16 U$1.13 | v101.26,70.32 92.47,70.32 91.06,68.91 91.06,68.21 U$5.13 | v108.64,38.32 108.64,37.27 108.47,37.09 | v81.22,23.91 77.7,27.43 55.9,27.43 50.63,32.7 49.93,32.7 49.75,32.88
  Bottom 0.5: v49.22,32.35 46.76,32.35 42.9,36.22 41.84,36.22 34.1,43.95 v34.1,45.36 | J1.8 138.18,14.06 128.33,23.91 v121.65,23.91 v81.22,23.91 | v101.26,70.32 101.26,65.05 109.7,56.61 109.7,51.33 112.51,48.52 112.51,42.19 v108.64,38.32
AUDIO_R-1
  Top 0.5: U$1.7 98.45,25.67 98.45,24.61 108.64,14.42 113.22,14.42 114.97,12.66 114.97,9.85 118.14,6.68 X1.2
AUDIO_R-2
  Top 0.5: U$2.7 48.87,15.82 51.69,13.01 51.69,6.68 X2.2
AUDIO_R-3
  Top 0.5: U$3.7 23.21,47.11 23.91,47.11 25.32,45.71 25.32,42.54 17.58,34.81 6.33,34.81 X3.2
AUDIO_R-4
  Top 0.5: U$4.7 29.89,79.11 29.89,78.06 28.48,76.65 25.32,76.65 17.23,84.74 17.23,93.88 X4.2
AUDIO_R-5
  Top 0.5: U$5.7 92.12,77.35 92.12,82.98 87.2,87.9 87.2,90.36 83.68,93.88 X5.2
BLUE  (via drill 0.61)
  Top 0.5: v45.36,32.35 46.06,33.05 46.06,34.1 U$2.16 | v34.1,48.87 33.05,49.93 32.35,49.93 U$3.16 32,49.93 30.94,49.93 29.53,51.33 29.53,61.18 32.35,63.99 32.35,69.62 U$4.16 | 98.62,39.55 100.91,41.84 139.59,41.84 143.1,38.32 143.1,13.71 140.99,11.6 J1.5 140.99,11.25 142.4,9.85 142.4,5.63 141.69,4.92 137.83,4.92 132.91,9.85 126.58,9.85 119.9,3.16 83.33,3.16 62.94,23.56 v54.15,23.56 | 98.62,39.55 95.99,36.92 95.99,35.16 U$1.16 | v94.58,64.34 94.58,67.86 U$5.16 | 98.62,39.55 v97.04,41.14
  Bottom 0.5: v34.1,48.87 33.05,47.82 33.05,43.95 44.65,32.35 v45.36,32.35 v54.15,23.56 | v94.58,64.34 94.58,58.01 97.04,55.55 v97.04,41.14
BLUE-1
  Top 0.5: U$1.4 94.93,25.67 94.93,24.61 105.13,14.42 106.18,14.42 108.64,11.95 X1.7
BLUE-2
  Top 0.5: U$2.4 45.01,24.96 45.01,14.77 42.19,11.95 X2.7
BLUE-3
  Top 0.5: U$3.4 22.85,50.98 17.93,50.98 11.25,44.3 X3.7
BLUE-4
  Top 0.5: U$4.4 33.75,79.46 33.75,81.57 26.72,88.6 X4.7
BLUE-5
  Top 0.5: U$5.4 95.99,77.35 95.99,85.79 93.17,88.6 X5.7
GND  (via drill 0.61)
  Top 0.5: J1.9 140.64,16.52 138.53,16.52 J1.10 138.18,16.88 137.62,22.5 133.96,27.07 I2C-2.4 | 139.94,38.32 139.94,39.03 JP1.3 | 139.94,38.32 139.94,36.57 JP1.2 | 139.94,38.32 133.61,38.32 I2C-1.4 133.26,38.68 133.26,39.73 131.85,41.14 124.82,41.14 124.47,40.79 120.6,40.79 C2.2 | S1.3 143.45,63.99 143.45,68.91 R16.1 143.1,69.27 140.64,71.73 140.64,74.54 D5.K | v135.1,81.4 135.37,81.57 135.37,82.63 138.88,86.14 J3.GND 138.88,86.49 135.37,90.01 J3.GNDBREAK 135.01,90.01 120.95,90.01 119.9,88.95 X5.21 | X5.5 89.31,88.95 89.31,92.12 87.55,93.88 X5.4 | 88.6,74.54 88.6,77 U$5.10 88.25,77 74.89,77 73.48,75.59 73.48,73.84 74.89,72.43 J4.6 74.89,72.08 72.08,69.27 68.21,69.27 IC2.8 67.86,69.27 63.64,73.48 50.98,73.48 47.11,77.35 42.19,77.35 C4.2 | 88.6,74.54 88.6,68.21 U$5.11 | R19.1 91.77,55.55 95.28,55.55 R18.1 95.64,55.55 98.8,55.55 R17.1 | 88.6,74.54 104.07,74.54 105.48,75.95 C6.2 | X5.18 113.92,93.88 111.46,91.42 107.24,91.42 104.78,88.95 X5.13 | U$4.10 26.02,79.46 26.02,85.44 22.85,88.6 X4.5 | X4.9 30.59,88.95 31.29,88.95 33.75,91.42 35.51,91.42 37.97,88.95 X4.13 | U$4.11 26.02,69.62 26.02,61.18 24.26,59.42 C5.2 24.26,59.07 25.32,58.01 25.32,49.22 30.94,43.6 32,43.6 U$3.11 | X3.9 10.9,48.17 10.9,48.87 8.79,50.98 8.79,53.09 10.9,55.2 X3.13 10.9,55.55 8.79,57.66 8.79,62.23 6.33,64.69 X3.18 | U$3.10 22.85,43.25 14.77,43.25 11.95,40.43 11.25,40.43 X3.5 | 112.86,9.14 112.86,8.44 114.62,6.68 X1.4 | 112.86,9.14 112.86,11.6 X1.5 | 112.86,9.14 107.59,9.14 105.13,11.6 X1.9 104.78,11.6 102.32,9.14 100.21,9.14 97.75,11.6 X1.13 97.39,11.6 94.93,9.14 90.71,9.14 88.25,6.68 X1.18
  Top 0.5: X2.21 15.82,11.95 21.1,6.68 X2.18 21.45,6.68 23.91,9.14 28.13,9.14 30.59,11.6 X2.13 | X2.4 47.82,6.68 47.82,9.85 46.06,11.6 X2.5 45.71,11.6 43.25,9.14 41.14,9.14 38.68,11.6 X2.9 | J5.P$6 42.54,42.9 45.01,42.9 52.39,35.51 52.39,34.46 U$2.11 52.74,34.1 54.5,34.1 58.37,30.24 73.84,30.24 76.83,33.23 | 102.32,28.13 102.32,34.81 U$1.11 | 102.32,28.13 102.32,26.02 U$1.10 | U$2.10 52.74,24.96 57.31,24.96 C7.2 | IC1.22 69.97,49.93 69.97,47.11 72.08,45.01 72.08,42.54 IC1.8 | 76.83,33.23 76.3,33.75 76.3,35.51 Y1.2 | 76.83,33.23 83.15,26.9 | 83.15,26.9 83.33,26.72 86.14,26.72 C8.2 86.49,26.72 87.9,28.13 102.32,28.13 | 83.15,26.9 82.27,26.02 82.27,11.95 X1.21
  Bottom 0.5: C2.2 120.25,40.79 120.25,50.28 118.84,51.69 C1.- | I2C-2.4 133.61,27.43 133.61,38.32 I2C-1.4 | D5.K 140.29,74.89 140.29,78.41 137.12,81.57 135.37,81.57 v135.1,81.4 | X5.18 114.27,93.88 119.54,88.6 X5.21 | 105.48,86.14 105.48,87.9 104.78,88.6 X5.13 | 105.48,86.14 105.48,76.3 C6.2 105.48,75.95 99.15,69.62 99.15,55.55 R17.1 | 105.48,86.14 100.21,86.14 97.75,88.6 97.04,88.6 X5.9 96.69,88.6 94.23,86.14 92.82,86.14 90.36,88.6 89.66,88.6 X5.5 | JP1.3 139.94,39.38 139.94,60.48 143.1,63.64 S1.3 | 24.61,90.36 23.21,88.95 X4.5 22.85,88.6 21.8,88.6 17.23,84.03 15.12,84.03 14.42,83.33 14.42,74.19 11.25,71.02 X3.21 11.25,70.67 6.33,65.75 6.33,65.05 X3.18 | 24.61,90.36 25.67,91.42 27.78,91.42 30.24,88.95 X4.9 | 24.61,90.36 21.1,93.88 X4.4 | X4.21 53.09,88.95 47.82,94.23 X4.18 47.47,93.88 43.6,90.01 43.6,87.2 41.66,85.26 | 41.66,85.26 38.32,88.6 X4.13 | 41.66,85.26 41.84,85.09 41.84,77.7 C4.2 | X3.4 6.33,38.68 9.49,38.68 10.9,40.08 X3.5 10.9,40.43 8.79,42.54 8.79,44.65 10.9,46.76 10.9,47.82 X3.9 | C5.2 23.91,59.07 14.77,59.07 11.25,55.55 X3.13 | X1.18 87.9,6.68 87.2,6.68 82.27,11.6 X1.21 | X2.13 30.94,11.95 31.64,11.95 34.1,14.42 35.86,14.42 38.32,11.95 X2.9 | 72.61,39.2 75.95,35.86 Y1.2 | 72.61,39.2 72.43,39.38 72.43,42.19 IC1.8 | 72.61,39.2 72.43,39.03 70.32,39.03 57.66,26.37 57.66,25.32 C7.2 57.31,24.96 56.96,24.61 56.96,17.23 55.9,16.17 50.98,16.17 46.76,11.95 46.06,11.95 X2.5 | IC2.8 68.21,68.91 68.21,51.69 69.62,50.28 IC1.22
  other vias: 30.9,81.9 53.3,79.6 58,83.1 62.4,80.7 68.6,87.9 74.2,83.7 67.4,93.1 86.7,84.3 94.3,83.7 108.9,77.4 108.5,60.5 81.4,92.9 39.2,66.2 44.1,62.5 47.9,68.1 53.2,58.2 58.3,56.6 61.9,55.9 61.9,62.5 65.9,60.4 83.7,62.1 96.2,60.3 85.4,39.5 91.4,41.2 81,38.2 104.7,40.7 105.8,35.9 115.2,27.6 120.3,31 102.3,19.1 66.4,34.8 61.1,35.9 50.3,30.2 46.4,29 51.5,15.2 17.8,48.3 36.3,51.7 38.9,51.4 75.19,64.55 72.38,64.78 71.26,62.24 86.37,52.74 102.78,52.43 114.76,48.85 134.2,12.2 123,2.9 122.39,8.62 91.98,63.81 30.86,66.79 57.11,39.58 120.6,21.8 57.83,74.17
  pour Bottom: 0,100.1 146.6,100.1 146.6,0.1 0,0.1
  pour Top: 0,100.1 146.6,100.1 146.6,0.1 0,0.1
GREEN  (via drill 0.61)
  Top 0.5: v45.01,37.27 45.01,34.46 U$2.17 | v34.1,50.63 33.4,50.63 33.05,50.98 32.35,50.98 U$3.17 | v33.75,65.75 33.75,69.62 U$4.17 | v95.64,66.1 95.64,67.51 95.99,67.86 U$5.17 | U$1.17 94.58,35.16 v94.58,39.73 94.58,40.08 97.39,42.9 v125.52,42.9
  Bottom 0.5: v45.01,37.27 36.22,46.06 36.22,48.52 v34.1,50.63 33.75,50.98 v33.75,65.75 33.75,69.97 39.73,75.95 46.76,75.95 61.53,90.71 75.95,90.71 82.63,97.39 106.18,97.39 108.64,94.93 108.64,91.77 110.75,89.66 110.75,62.94 125.52,48.17 v125.52,42.9 131.5,42.9 135.01,39.38 135.01,36.22 142.4,28.83 142.4,10.55 140.99,9.14 J1.3 | v94.58,39.73 94.58,40.79 90.36,45.01 90.36,65.75 91.06,66.45 95.28,66.45 v95.64,66.1
GREEN-1
  Top 0.5: U$1.3 93.53,25.67 93.53,19.69 101.26,11.95 X1.11
GREEN-2
  Top 0.5: U$2.3 43.6,24.96 43.6,20.74 34.81,11.95 X2.11
GREEN-3
  Top 0.5: U$3.3 22.85,52.39 11.95,52.39 11.25,51.69 X3.11
GREEN-4
  Top 0.5: U$4.3 34.81,79.46 34.81,88.25 34.46,88.6 X4.11
GREEN-5
  Top 0.5: U$5.3 97.39,77.35 97.39,85.44 100.56,88.6 X5.11
N$1
  Top 0.5: IC2.3 55.2,69.27 53.44,71.02 48.17,71.02 40.08,62.94 40.08,33.05 46.41,26.72 60.83,26.72 83.68,3.87 104.42,3.87 106.89,6.33 X1.8
N$2  (via drill 0.61)
  other vias: 47.4,74.6
N$4
  Bottom 0.5: IC2.5 60.48,68.91 60.48,51.69 60.83,51.33 60.83,37.97 55.2,32.35 55.2,23.21 46.41,14.42 45.36,14.42 43.95,13.01 43.95,10.2 40.43,6.68 X2.8
N$7
  Top 0.5: IC2.7 65.4,69.27 61.88,72.78 41.84,72.78 41.14,73.48 7.74,73.48 3.52,69.27 3.52,48.52 5.98,46.06 X3.8
N$10
  Top 0.5: IC2.9 67.86,76.65 67.86,81.22 52.39,96.69 31.29,96.69 28.83,94.23 X4.8
N$14
  Bottom 0.5: IC2.11 62.94,76.65 62.94,78.41 71.38,86.84 78.06,86.84 80.17,88.95 80.17,90.71 80.87,91.42 92.47,91.42 94.93,93.88 X5.8
N$15
  Top 0.5: IC1.9 74.54,42.19 74.54,36.57 73.84,35.86 Y1.1
N$16
  Bottom 0.5: IC1.10 77.7,42.19 77.7,41.14 78.41,40.43 78.41,35.86 Y1.3
N$17
  Bottom 0.5: IC1.27 56.96,50.28 56.96,61.88 56.61,62.23 56.61,84.74 61.88,90.01 76.3,90.01 82.98,96.69 103.02,96.69 104.78,94.93 104.78,91.77 106.89,89.66 106.89,65.75 124.47,48.17 124.47,42.54 128.33,38.68 I2C-1.2 128.69,38.32 128.69,27.43 I2C-2.2
N$18  (via drill 0.61)
  Top 0.5: v71.02,33.4 71.02,37.62 70.32,38.32 61.53,38.32 58.37,41.49 58.37,43.6 54.85,47.11 54.85,49.93 IC1.28
  Bottom 0.5: v71.02,33.4 71.02,32.35 78.41,24.96 129.04,24.96 131.15,27.07 I2C-2.3 131.15,27.43 131.15,38.32 I2C-1.3
N$19  (via drill 0.61)
  Top 0.5: JP9.1 131.15,46.41 135.01,46.41 135.37,46.76 142.05,46.76 143.1,45.71 S2.1 | v68.56,85.44 70.67,85.44 81.92,96.69 118.49,96.69 119.54,95.64 119.54,91.77 118.14,90.36 118.14,86.84 135.72,69.27 R16.2
  Bottom 0.5: v68.56,85.44 64.69,85.44 59.07,79.81 59.07,67.86 59.42,67.51 59.42,50.28 IC1.26 | JP9.1 131.15,46.41 134.31,49.58 134.31,67.51 135.72,68.91 R16.2
N$20  (via drill 0.61)
  Top 0.5: v71.02,44.65 67.51,48.17 67.51,49.93 IC1.23 | v77,40.43 82.98,40.43 83.68,41.14 83.68,43.6 84.38,44.3 107.59,44.3 110.75,47.47 SW1.6
  Bottom 0.5: R17.2 99.15,48.17 104.07,48.17 105.48,49.58 109,49.58 110.75,47.82 SW1.6 | v71.02,44.65 72.43,44.65 73.48,43.6 73.48,41.49 74.54,40.43 v77,40.43
N$21  (via drill 0.61)
  Top 0.5: R18.2 95.64,48.17 97.75,48.17 99.15,49.58 106.53,49.58 108.29,47.82 SW1.5 108.29,47.47 105.83,45.01 v76.3,45.01
  Bottom 0.5: v76.3,45.01 75.59,45.71 69.27,45.71 65.05,49.93 IC1.24
N$22
  Top 0.5: SW1.4 105.83,47.47 104.78,46.41 95.28,46.41 93.88,47.82 91.77,47.82 R19.2 91.42,47.82 89.66,46.06 75.95,46.06 73.48,43.6 73.48,41.14 72.78,40.43 64.34,40.43 63.29,41.49 63.29,43.95 62.23,45.01 62.23,49.93 IC1.25
N$23
  Top 0.5: C3.1 48.17,55.9 42.54,55.9 J5.P$1
N$24
  Top 0.5: R26.1 144.16,79.81 143.1,79.81 138.18,74.89 D5.A
N$25
  Top 0.5: D6.A 130.79,80.17 130.79,85.09 131.85,86.14 J3.PWR
N$26
  Top 0.5: U$5.9 89.66,77.35 89.66,78.06 81.57,86.14 81.22,86.14 77.7,89.66 76.65,89.66 75.24,88.25 LED5.K
N$27
  Top 0.5: LED5.A 77.7,87.9 77.7,84.03 79.11,82.63 R24.2
N$28
  Top 0.5: LED4.A 11.25,88.25 11.25,84.74 13.01,82.98 R23.2
N$29
  Top 0.5: U$4.9 27.43,79.11 27.43,78.06 26.72,77.35 25.67,77.35 20.74,82.27 20.74,91.06 18.64,93.17 18.64,95.64 17.58,96.69 16.52,96.69 8.44,88.6 LED4.K
N$30
  Top 0.5: U$2.9 51.69,24.96 51.69,23.91 56.96,18.64 58.72,18.64 60.48,16.88 60.48,11.95 LED2.K
N$31
  Top 0.5: LED2.A 58.37,11.95 58.37,17.23 R21.2
N$32
  Top 0.5: U$3.9 22.85,44.65 15.12,44.65 13.01,42.54 9.14,42.54 7.74,43.95 4.57,43.95 3.52,42.9 3.52,32.35 9.49,26.37 9.49,22.5 10.9,21.1 LED3.K
N$34
  Top 0.5: LED3.A 11.25,23.56 12.66,23.56 15.82,26.72 R22.2
N$35
  Top 0.5: R20.2 124.82,17.58 124.82,12.31 LED1.A
N$36
  Top 0.5: U$1.9 101.26,25.67 101.26,24.61 110.05,15.82 119.54,15.82 123.41,11.95 123.41,11.6 124.11,10.9 126.22,10.9 127.28,11.95 LED1.K
RED  (via drill 0.61)
  Top 0.5: v43.6,37.27 43.6,34.46 U$2.18 | v35.16,48.17 35.16,50.98 33.75,52.39 32.35,52.39 U$3.18 32,52.39 31.29,52.39 30.24,53.44 30.24,60.83 34.81,65.4 34.81,69.62 U$4.18 | 112.34,46.59 112.51,46.76 112.51,63.29 106.18,69.62 101.96,69.62 101.61,69.27 100.91,69.27 100.56,69.62 98.1,69.62 97.39,68.91 97.39,68.21 U$5.18 | 112.34,46.59 109.35,43.6 97.04,43.6 93.53,40.08 93.53,35.16 U$1.18 93.17,34.81 93.17,33.75 92.47,33.05 85.79,33.05 84.74,34.1 v80.17,34.1 | v130.79,44.65 114.27,44.65 112.34,46.59 | v69.97,37.27 v58.72,37.27
  Bottom 0.5: v35.16,48.17 35.16,45.71 v43.6,37.27 44.65,36.22 57.66,36.22 v58.72,37.27 | v130.79,44.65 135.72,39.73 135.72,37.97 138.53,35.16 140.99,35.16 143.1,33.05 143.1,8.79 140.99,6.68 J1.1 | v69.97,37.27 73.13,34.1 v80.17,34.1
RED-1
  Top 0.5: U$1.2 92.12,25.67 92.12,13.36 93.53,11.95 X1.15
RED-2
  Top 0.5: U$2.2 42.54,24.96 42.54,23.91 33.05,14.42 29.53,14.42 27.07,11.95 X2.15
RED-3
  Top 0.5: U$3.2 22.85,53.8 16.52,53.8 11.25,59.07 X3.15
RED-4
  Top 0.5: U$4.2 36.57,79.46 36.57,83.33 41.84,88.6 X4.15
RED-5
  Top 0.5: U$5.2 98.8,77.35 98.8,79.11 108.29,88.6 X5.15
RESET  (via drill 0.61)
  Top 0.5: C3.2 48.52,47.82 53.8,42.54 54.5,42.54 IC1.1 54.85,42.19 54.85,38.32 61.88,31.29 v73.48,31.29 | S1.1 143.1,59.07 139.59,55.55 135.72,55.55 R15.2 135.37,55.55 117.43,73.48 v101.61,73.48
  Bottom 0.5: 88.95,77 98.1,77 v101.61,73.48 | 88.95,77 77.35,77 75.24,74.89 J4.5 | v73.48,31.29 79.81,31.29 88.95,40.43 88.95,77
RX
  Top 0.5: IC1.2 56.96,42.54 46.41,53.09 42.54,53.09 J5.P$2
SEL_1
  Top 0.5: U$1.19 92.12,35.16 92.12,37.97 87.9,42.19 IC1.14
SEL_2  (via drill 0.61)
  Top 0.5: v42.54,32 42.54,34.1 U$2.19
  Bottom 0.5: v42.54,32 42.54,15.12 40.08,12.66 40.08,9.49 38.68,8.09 38.68,4.92 39.73,3.87 52.04,3.87 59.42,11.25 59.42,23.21 70.67,34.46 71.73,34.46 72.78,33.4 79.46,33.4 79.81,33.05 80.52,33.05 83.68,36.22 83.68,46.06 87.55,49.93 IC1.15
SEL_3  (via drill 0.61)
  Top 0.5: v36.57,53.8 32.35,53.8 U$3.19 | v53.8,65.05 56.61,67.86 56.61,70.32 57.31,71.02 58.37,71.02 59.07,70.32 59.07,63.29 71.02,51.33 71.02,48.87 73.13,46.76 81.57,46.76 84.74,49.93 IC1.16
  Bottom 0.5: v36.57,53.8 38.32,53.8 49.58,65.05 v53.8,65.05
SEL_4  (via drill 0.61)
  Top 0.5: v36.92,71.73 36.57,71.38 36.57,69.97 U$4.19 | v55.55,71.73 60.12,71.73 61.53,70.32 61.53,64.69 62.59,63.64 67.51,63.64 67.68,63.81 | 67.68,63.81 74.54,70.67 75.95,70.67 77.35,72.08 J4.4 | 67.68,63.81 73.48,58.01 73.48,49.22 75.24,47.47 80.87,47.47 82.27,48.87 82.27,49.93 IC1.17
  Bottom 0.5: v55.55,71.73 v36.92,71.73
SEL_5
  Top 0.5: 91.24,62.76 81.57,72.43 81.57,73.13 80.17,74.54 J4.1 | 91.24,62.76 91.42,62.59 94.23,62.59 98.45,66.8 98.45,67.86 U$5.19 | 91.24,62.76 80.17,51.69 80.17,50.28 IC1.18
SEL_EX  (via drill 0.61)
  Top 0.5: 77.7,74.89 J4.3 | v77.7,67.86 77.7,50.28 IC1.19
  Bottom 0.5: v77.7,67.86 81.57,71.73 81.57,75.59 80.87,76.3 79.11,76.3 77.7,74.89 J4.3
SIG_1
  Top 0.5: IC2.2 52.74,68.91 52.74,66.45 R8.1 52.74,66.1 52.74,64.69 55.9,61.53 55.9,48.52 61.88,42.54 IC1.4
SIG_2
  Top 0.5: IC2.4 58.01,68.91 58.01,62.94 R2.1 58.01,62.59 63.29,57.31 63.29,49.22 64.69,47.82 64.69,42.54 IC1.5
SIG_3
  Top 0.5: R5.1 62.94,65.05 62.94,68.91 IC2.6
  Bottom 0.5: IC1.6 67.16,42.54 67.16,45.36 63.29,49.22 63.29,64.69 R5.1
SIG_4
  Top 0.5: IC2.10 65.75,76.65 65.75,78.76 R10.1
  Bottom 0.5: IC1.11 79.81,42.54 79.81,47.82 78.76,48.87 78.76,63.29 65.75,76.3 IC2.10
SIG_5
  Top 0.5: IC2.12 60.48,76.65 60.48,79.11 R13.1
  Bottom 0.5: IC1.12 82.27,42.19 80.52,40.43 79.46,40.43 78.76,41.14 78.76,43.95 73.48,49.22 73.48,65.75 64.69,74.54 62.23,74.54 60.48,76.3 IC2.12
SYNC  (via drill 0.61)
  Top 0.5: v46.41,37.27 47.47,36.22 47.47,34.46 U$2.15 | U$3.15 32.35,48.52 33.05,48.52 35.16,46.41 v37.27,46.41 37.62,46.76 37.62,61.53 43.25,67.16 43.25,70.32 40.79,72.78 33.05,72.78 31.29,71.02 31.29,69.97 U$4.15 | 98.97,37.8 100.56,39.38 124.11,39.38 125.17,40.43 131.5,40.43 132.2,39.73 132.2,36.92 133.96,35.16 140.99,35.16 142.4,33.75 142.4,15.47 140.99,14.06 J1.7 | 98.97,37.8 97.39,36.22 97.39,35.16 U$1.15 97.04,34.81 97.04,33.75 95.64,32.35 v79.11,32.35 | v93.53,63.64 93.53,67.86 U$5.15 | v98.45,37.97 98.8,37.97 98.97,37.8 | v57.31,37.27 62.23,32.35 v74.54,32.35
  Bottom 0.5: v37.27,46.41 37.27,46.06 41.84,41.49 42.19,41.49 v46.41,37.27 v57.31,37.27 | v93.53,63.64 93.53,42.9 v98.45,37.97 | v79.11,32.35 v74.54,32.35
SYNC-1
  Top 0.5: U$1.5 95.64,26.02 95.64,27.07 95.28,27.43 90.36,27.43 84.38,21.45 84.38,6.68 X1.20
SYNC-2
  Top 0.5: U$2.5 46.06,25.32 46.06,26.02 45.36,26.72 27.43,26.72 14.06,13.36 14.06,9.85 17.23,6.68 X2.20
SYNC-3
  Top 0.5: U$3.5 23.21,49.93 23.91,49.93 24.61,50.63 24.61,55.55 14.77,65.4 9.49,65.4 6.33,68.56 X3.20
SYNC-4
  Top 0.5: U$4.5 32.7,79.11 32.7,78.06 33.4,77.35 37.97,77.35 47.82,87.2 47.82,90.36 51.33,93.88 X4.20
SYNC-5
  Top 0.5: U$5.5 94.93,77 94.93,75.95 95.64,75.24 101.61,75.24 114.27,87.9 114.27,90.36 117.79,93.88 X5.20
TX
  Bottom 0.5: IC1.3 59.42,42.54 51.69,50.28 42.54,50.28 J5.P$3